# Altium schematic sheet LED.SchDoc
size A4; SheetNumber: 1; SheetTotal: 1
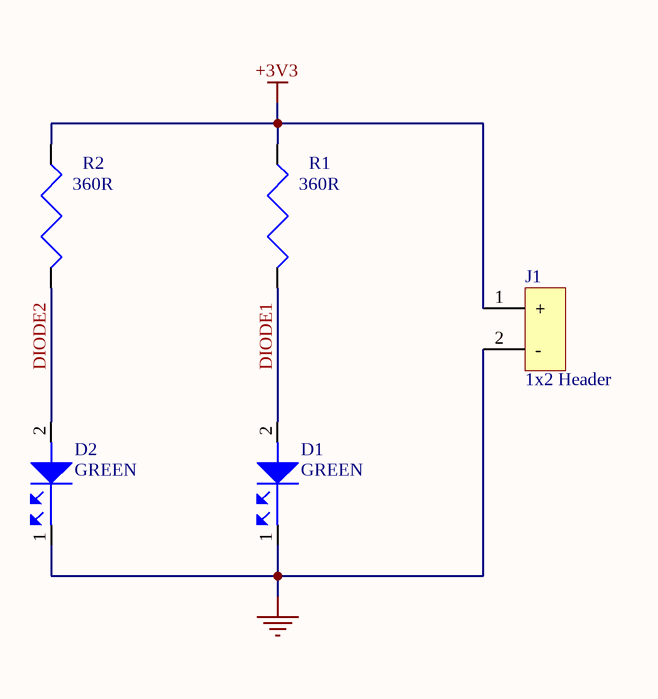
[diagram p0: LED.SchDoc]

## Parts
D1  GREEN  [LED0603G]
D2  GREEN  [LED0603G]
J1  1x2 Header  [HDR1X2]
R1  360R  [R0805]
R2  360R  [R0805]

## Nets
+3V3: J1.1(+) R1.64 R2.64
GND: D1.1 D2.1 J1.2(-)
DIODE1: D1.2
DIODE2: D2.2

Not connected (* = marked no-connect by the designer): R1 65; R2 65

## Library data of the parts
D1 D2 = LSM0603453V: LED GREEN CLEAR CHIP 0603 SMD; Manufacturer: Visual Communications; Lens Color: Colorless; Lens Style: Flat; Luminous Intensity: 63mcd; Forward Voltage: 2V; Test Current: 20mA; Viewing Angle: 120°; Dominant Wavelength: 572nm; Power Dissipation: 60mW; Reverse Voltage: 5V; Wavelength: 576nm; Lens Size: 0.8mm; Description: LED SM 0603 3V -/1000/-mcd Green | VCC (Visual Communications Company) LSM0603453V; Supplier: Digikey; Supplier Part Number: LSM0603453VDKR-ND; Manufacturer Part Number: LSM0603453V; RoHS: Yes; Category: LEDs; Stock: 92418; Pricing: 1=0.46, 10=0.283, 100=0.1626, 1000=0.12726, 2000=0.11666 (USD); Mounting Technology: Surface Mount; Case/Package: 0603; Color: Green; Case Code (Imperial): 0603; Case Code (Metric): 1608; Min Operating Temperature: -40°C; Max Operating Temperature: 85°C; Packaging: Cut Tape; Lens Transparency: Clear; Series: LSM0603; Forward Current: 20mA; Length: 1.6mm; Width: 0.8mm; Height: 0.65mm; RoHS Compliant: Yes; ComponentLink1URL: http://www.farnell.com/datasheets/2699708.pdf?src-supplier=Farnell; ComponentLink1Description: http://www.farnell.com/datasheets/2699708.pdf?src-supplier=Farnell; ComponentLink2URL: http://www.farnell.com/datasheets/2699708.pdf?src-supplier=Newark; ComponentLink2Description: http://www.farnell.com/datasheets/2699708.pdf?src-supplier=Newark; ComponentLink3URL: https://vcclite.com/wp-content/uploads/wpallimport/files/files/LSM0603453V.pdf?src-supplier=Digikey; ComponentLink3Description: https://vcclite.com/wp-content/uploads/wpallimport/files/files/LSM0603453V.pdf?src-supplier=Digikey
J1 = 22-27-2021: CONN HEADER VERT 2POS 2.54MM; Manufacturer: Molex; Plating: 154ConductorMaterial; Number of Positions: 2; Current Rating: 4A; Voltage Rating: 500V; Gender: Male; Voltage Rating (DC): 250V; Description: KK 254 Wire-to-Board Header, Vertical, with Friction Lock, 2 Circuits, Tin (Sn) Plating; Supplier: Digikey; Manufacturer Part Number: 22-27-2021; RoHS: Yes; Category: Headers and Wire Housings; Stock: 86413; Pricing: 1=0.3, 10=0.245, 100=0.18, 3000=0.1309, 6000=0.12272, 12000=0.11044 (USD); Contact Plating: Tin; Contact Material: Tin; Housing Color: Natural; Housing Material: Nylon; Material: Nylon; Weight: 0.00769oz; Number of Rows: 1; Packaging: Bulk; Termination: Through Hole; Series: 6410; Package Quantity: 24000; Contact Gender: Male; Contact Type: -; Pitch: 2.54mm; RoHS Compliant: Yes; Lead Free: Lead Free; Flammability Rating: UL94 V-0; Reach SVHC Compliant: 4187SVHC; Supplier Part Number: WM4111-ND
R1 R2 = AC0805FR-10360RL: RES 360 OHM 1% 1/8W 0805; Manufacturer: Yageo; Description: Resistor Thick Film 360Ohm 1% 0805 2-Pin Paper T/R; Supplier: Digikey; Supplier Part Number: 13-AC0805FR-10360RLDKR-ND; Manufacturer Part Number: AC0805FR-10360RL; RoHS: Yes; Category: Chip SMD Resistors; Pricing: 1=0.1, 10=0.031, 50=0.0198, 100=0.0166, 500=0.01152, 1000=0.00997, 5000=0.00736 (USD); Case/Package: 339Case; Packaging: 10Packaging; Value: 360R; RoHS Compliant: Yes